# Altium project extBoard.PrjPcb
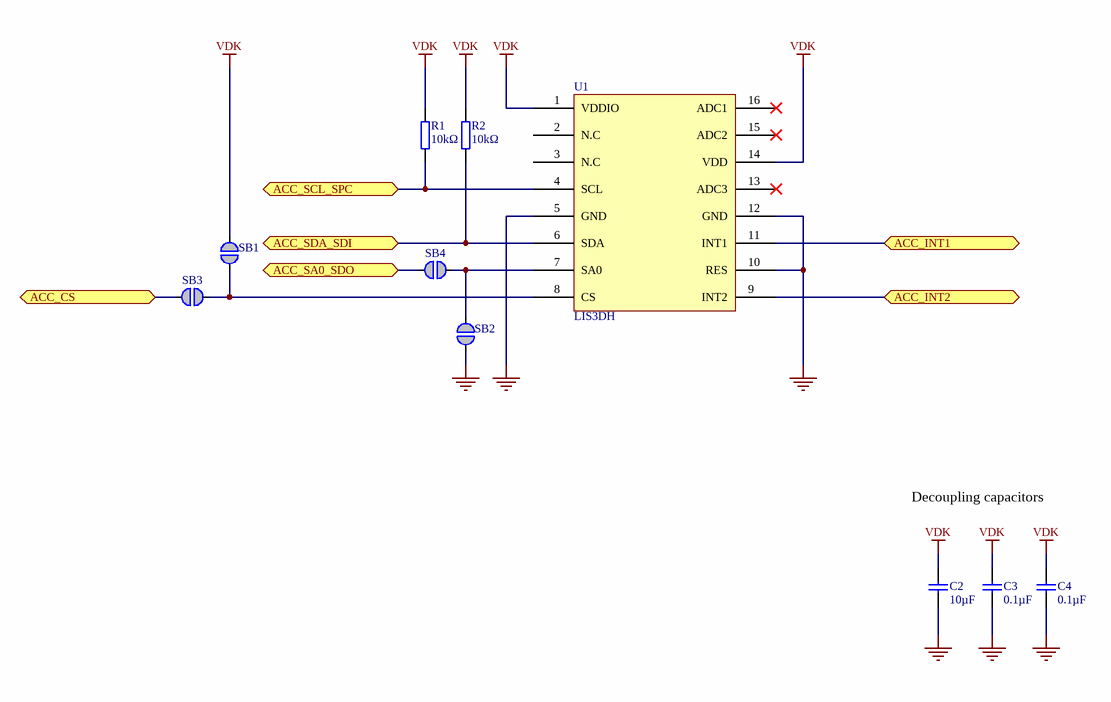
[diagram p0: extBoard_sheet2_acc.SchDoc]
4 sheets, 43 parts. Net scope: flat (ports and power ports of the same name join across sheets).
Board file: extBoard.PcbDoc
Sheets:
  extBoard_sheet2_acc.SchDoc
  extBoard_sheet3_interrupt_generator.SchDoc
  extBoard_sheet4_adc.SchDoc
  extBoard_sheet5_connectors.SchDoc

## Sheet extBoard_sheet2_acc.SchDoc: EXT BOARD - Accelerometer
size A4; Revision: 0.1.0; SheetNumber: 2; SheetTotal: 5; Author: NALO; DrawnBy: NALO; DocumentSize: A4; PCAName: EXT BOARD; ProjectName: Bachelor's Thesis

### Parts
C2  10µF  [CAPC2012X11L]
C3  0.1µF  [CAPC2012X11L]
C4  0.1µF  [CAPC2012X11L]
R1  10kΩ  [R0805]
R2  10kΩ  [R0805]
SB1  Solderbridge  [Solderbridge]  (value not drawn)  (no BOM)
SB2  Solderbridge  [Solderbridge]  (value not drawn)  (no BOM)
SB3  Solderbridge  [Solderbridge]  (value not drawn)  (no BOM)
SB4  Solderbridge  [Solderbridge]  (value not drawn)  (no BOM)
U1  LIS3DH  [LGA-16 (3x3x1.0mm)]

### Ports
ACC_CS (bidir), ACC_INT1 (bidir), ACC_INT2 (bidir), ACC_SA0_SDO (bidir), ACC_SCL_SPC (bidir), ACC_SDA_SDI (bidir)

### Nets
GND: C2.1 C3.1 C4.1 SB2.2 U1.5(GND) U1.10(RES) U1.12(GND)
VDK: C2.2 C3.2 C4.2 R1.2 R2.2 SB1.1 U1.1(VDDIO) U1.14(VDD)
A0: R1.1 U1.4(SCL) ; port ACC_SCL_SPC
A1: R2.1 U1.6(SDA) ; port ACC_SDA_SDI
A2: SB4.1 ; port ACC_SA0_SDO
A3: SB3.2 ; port ACC_CS
A4: U1.9(INT2) ; port ACC_INT2
A5: U1.11(INT1) ; port ACC_INT1
NetSB1_2: SB1.2 SB3.1 U1.8(CS)
NetSB2_1: SB2.1 SB4.2 U1.7(SA0)

Not connected (* = marked no-connect by the designer): U1 2(N.C) 3(N.C) 13(ADC3)* 15(ADC2)* 16(ADC1)*

### Notes on the sheet
- Decoupling capacitors
- Title
- Size
- Date:
- Project Number
- Sheet         of
- Revision
- File:
- Drawn By:

### Library data of the parts
C2-C4 = CAP_0805: Capacitor, X5R, ±10%; Part Number: C0805-4µ7; Note: 16V; Artikkelnr Noca: 20039266; Artikkelnr Simpro: N.A.; Manufacturer: *; Manufacturer Part Number: *; Datasheet: *; Footprint Doc: 0805; LatestRevisionDate: 2013-06-04; Pin Count: 2; Publisher: Nordic Semiconductor; Published: 2009-08-21; Supplier: *; Supplier part number: *; 2nd source Supplier: *; 2nd source part number: *
  C2: Value: 10µF
  C3 C4: Value: 0.1µF
R1 R2 = R0805: Value: 10kΩ
SB1-SB4 = SOLDERBRIDGE: Artikkelnr Noca: N.A.; Part Number: Solderbridge; Manufacturer: *; Manufacturer Part Number: *; Datasheet: *; LatestRevisionDate: 2009-12-14; Pin Count: 2; Publisher: Nordic Semiconductor; Published: 2009-12-14; Value: Solderbridge; Note: *; Supplier: *; Supplier part number: *; 2nd source Supplier: *; 2nd source part number: *; Footprint Doc: Solderbridge; Artikkelnr Simpro: N.A.

## Sheet extBoard_sheet3_interrupt_generator.SchDoc: EXT BOARD - Interrupt Generator
size A4; Revision: 0.1.0; SheetNumber: 3; SheetTotal: 5; Author: NALO; DrawnBy: NALO; DocumentSize: A4; PCAName: EXT BOARD; ProjectName: Bachelor's Thesis
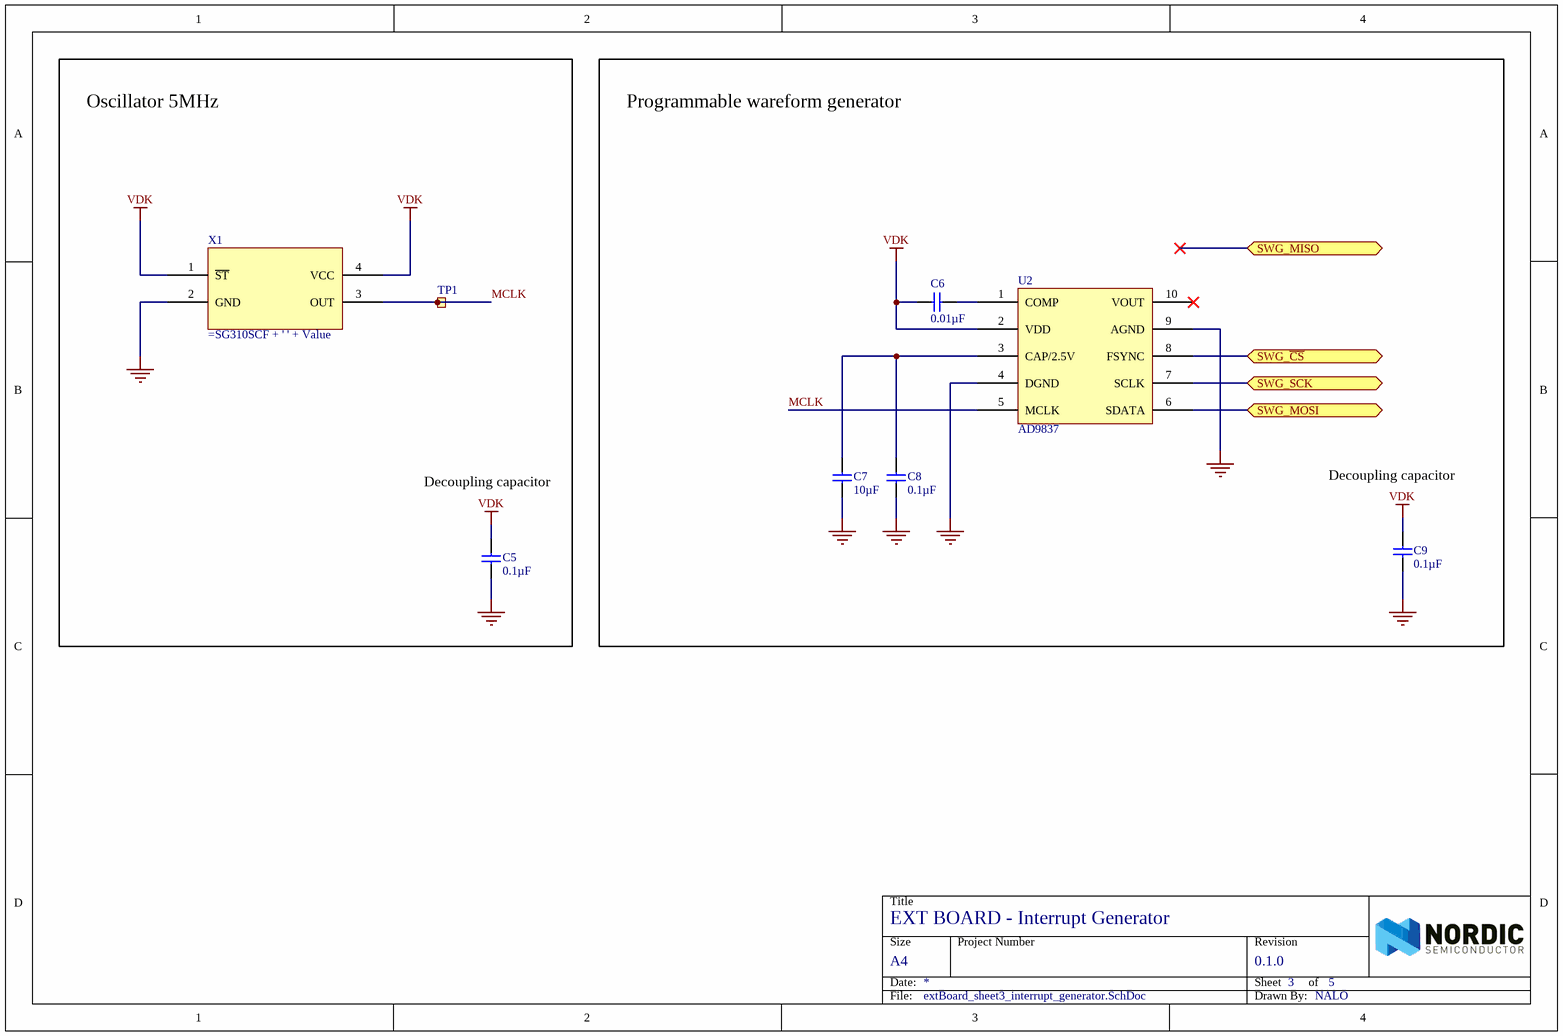
[diagram p1: extBoard_sheet3_interrupt_generator.SchDoc]

### Parts
C5  0.1µF  [CAPC2012X11L]
C6  0.01µF  [CAPC2012X11L]
C7  10µF  [CAPC2012X11L]
C8  0.1µF  [CAPC2012X11L]
C9  0.1µF  [CAPC2012X11L]
TP1  TP  [TESTPAD-TH]  (value not drawn)  (no BOM)
U2  AD9837  [DFN50P300X300X95-10N]
X1  (no value)  [SG310SCF]

### Blocks framed on the sheet
Oscillator 5MHz: C5 TP1 X1
Programmable wareform generator: C6-C9 U2

### Ports
SWG_MISO (bidir), SWG_MOSI (bidir), SWG_SCK (bidir), SWG_~{CS} (bidir)

### Nets
GND: C5.1 C7.1 C8.1 C9.1 U2.4(DGND) U2.9(AGND) X1.2(GND)
VDK: C5.2 C6.2 C9.2 U2.2(VDD) X1.1(~{ST}) X1.4(VCC)
D2: U2.8(FSYNC) ; port SWG_~{CS}
D3: U2.6(SDATA) ; port SWG_MOSI
D5: U2.7(SCLK) ; port SWG_SCK
MCLK: TP1.1 U2.5(MCLK) X1.3(OUT)
NetC6_1: C6.1 U2.1(COMP)
NetC7_2: C7.2 C8.2 U2.3(CAP/2.5V)

Not connected (* = marked no-connect by the designer): U2 10(VOUT)*

### Notes on the sheet
- Decoupling capacitor
- Title
- Size
- Date:
- Project Number
- Sheet         of
- Revision
- File:
- Drawn By:

### Library data of the parts
C5-C9 = CAP_0805: as C2 on sheet extBoard_sheet2_acc; Manufacturer: *; Manufacturer Part Number: *; Datasheet: *; Footprint Doc: 0805; LatestRevisionDate: 2013-06-04; Pin Count: 2; Publisher: Nordic Semiconductor; Published: 2009-08-21; Supplier: *; Supplier part number: *; 2nd source Supplier: *; 2nd source part number: *
  C5 C8 C9: Value: 0.1µF
  C6: Value: 0.01µF
  C7: Value: 10µF
TP1 = Testpoint TH: Testpoint, through hole; Artikkelnr Noca: N.A.; Part Number: Testpoint TH; Manufacturer: *; Manufacturer Part Number: *; Datasheet: *; Footprint Doc: TESTPAD-TH; LatestRevisionDate: 2009-12-12; Pin Count: 1; Publisher: Nordic Semiconductor; Published: 2009-12-12; Value: TP; Note: *; Supplier: *; Supplier part number: *; 2nd source Supplier: *; 2nd source part number: *; Artikkelnr Simpro: N.A.
X1 = SG310SCF: Value: 16MHz

## Sheet extBoard_sheet4_adc.SchDoc: EXT BOARD - A/D Converter
size A4; Revision: 0.1.0; SheetNumber: 4; SheetTotal: 5; Author: NALO; DrawnBy: NALO; DocumentSize: A4; PCAName: EXT BOARD; ProjectName: Bachelor's Thesis
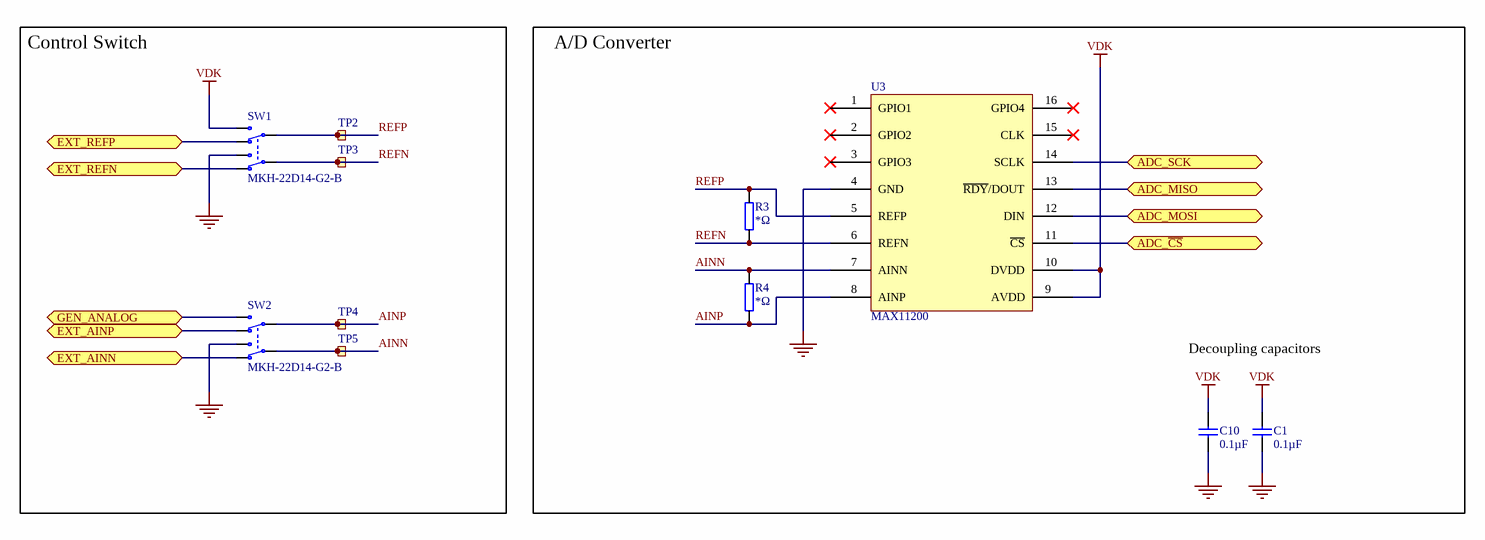
[diagram p2: extBoard_sheet4_adc.SchDoc]

### Parts
C1  0.1µF  [CAPC2012X11L]
C10  0.1µF  [CAPC2012X11L]
R3  *Ω  [R0805]
R4  *Ω  [R0805]
SW1  MKH-22D14-G2-B  [MKH-22D14-G2-B]
SW2  MKH-22D14-G2-B  [MKH-22D14-G2-B]
TP2  TP  [TESTPAD-TH]  (value not drawn)  (no BOM)
TP3  TP  [TESTPAD-TH]  (value not drawn)  (no BOM)
TP4  TP  [TESTPAD-TH]  (value not drawn)  (no BOM)
TP5  TP  [TESTPAD-TH]  (value not drawn)  (no BOM)
U3  MAX11200  [QSOP16]

### Blocks framed on the sheet
Control Switch: SW1 SW2 TP2-TP5
A/D Converter: C1 C10 R3 R4 U3

### Ports
ADC_MISO (bidir), ADC_MOSI (bidir), ADC_SCK (bidir), ADC_~{CS} (bidir), EXT_AINN (bidir), EXT_AINP (bidir), EXT_REFN (bidir), EXT_REFP (bidir), GEN_ANALOG (bidir)

### Nets
GND: C1.1 C10.1 SW1.1(N.O-1) SW2.1(N.O-1) U3.4(GND)
VDK: C1.2 C10.2 SW1.4(N.O-2) U3.9(AVDD) U3.10(DVDD)
ADC_~{CS}: U3.11(~{CS}) ; port ADC_~{CS}
ADC_MISO: U3.13(~{RDY}/DOUT) ; port ADC_MISO
ADC_MOSI: U3.12(DIN) ; port ADC_MOSI
ADC_SCK: U3.14(SCLK) ; port ADC_SCK
AINN: R4.2 SW2.2(COM-1) TP5.1 U3.7(AINN)
AINP: R4.1 SW2.5(COM-2) TP4.1 U3.8(AINP)
EXT_AINN: SW2.3(N.C-1) ; port EXT_AINN
EXT_AINP: SW2.6(N.C-2) ; port EXT_AINP
EXT_REFN: SW1.3(N.C-1) ; port EXT_REFN
EXT_REFP: SW1.6(N.C-2) ; port EXT_REFP
GEN_ANALOG: SW2.4(N.O-2) ; port GEN_ANALOG
REFN: R3.1 SW1.2(COM-1) TP3.1 U3.6(REFN)
REFP: R3.2 SW1.5(COM-2) TP2.1 U3.5(REFP)

Not connected (* = marked no-connect by the designer): U3 1(GPIO1)* 2(GPIO2)* 3(GPIO3)* 15(CLK)* 16(GPIO4)*

### Notes on the sheet
- Decoupling capacitors
- Title
- Size
- Date:
- Project Number
- Sheet         of
- Revision
- File:
- Drawn By:

### Library data of the parts
C1 C10 = CAP_0805: as C2 on sheet extBoard_sheet2_acc; Manufacturer: *; Manufacturer Part Number: *; Datasheet: *; Footprint Doc: 0805; LatestRevisionDate: 2013-06-04; Pin Count: 2; Publisher: Nordic Semiconductor; Published: 2009-08-21; Value: 0.1µF; Supplier: *; Supplier part number: *; 2nd source Supplier: *; 2nd source part number: *
R3 R4 = R0805: Value: *Ω
SW1 SW2 = MKH-22D14-G2-B: Slide Switch DPDT; Manufacturer: Dailywell; Artikkelnr Noca: 50019112; Artikkelnr Simpro: N.A.; Part Number: MKH-22D14-G2-B; Manufacturer Part Number: MKH-22D14-G2-B; Datasheet: \\hizz\pro\app9717\Datasheet\switches\Dailywell\MKH-22D14-G2-B.pdf; Footprint Doc: MKH-22D14-G2-B; LatestRevisionDate: 2016-08-18; Pin Count: 6; Publisher: Nordic Semiconductor; Published: 2016-08-18; Value: MKH-22D14-G2-B; Note: *; Supplier: *; Supplier part number: *; 2nd source Supplier: *; 2nd source part number: *
TP2-TP5 = Testpoint TH: as TP1 on sheet extBoard_sheet3_interrupt_generator; Part Number: Testpoint TH; Manufacturer: *; Manufacturer Part Number: *; Datasheet: *; Footprint Doc: TESTPAD-TH; LatestRevisionDate: 2009-12-12; Pin Count: 1; Publisher: Nordic Semiconductor; Published: 2009-12-12; Value: TP; Note: *; Supplier: *; Supplier part number: *; 2nd source Supplier: *; 2nd source part number: *; Artikkelnr Simpro: N.A.

## Sheet extBoard_sheet5_connectors.SchDoc: EXT BOARD - Connectors
size A4; Revision: 0.1.0; SheetNumber: 5; SheetTotal: 5; Author: NALO; DrawnBy: NALO; DocumentSize: A4; PCAName: EXT BOARD; ProjectName: Bachelor's Thesis
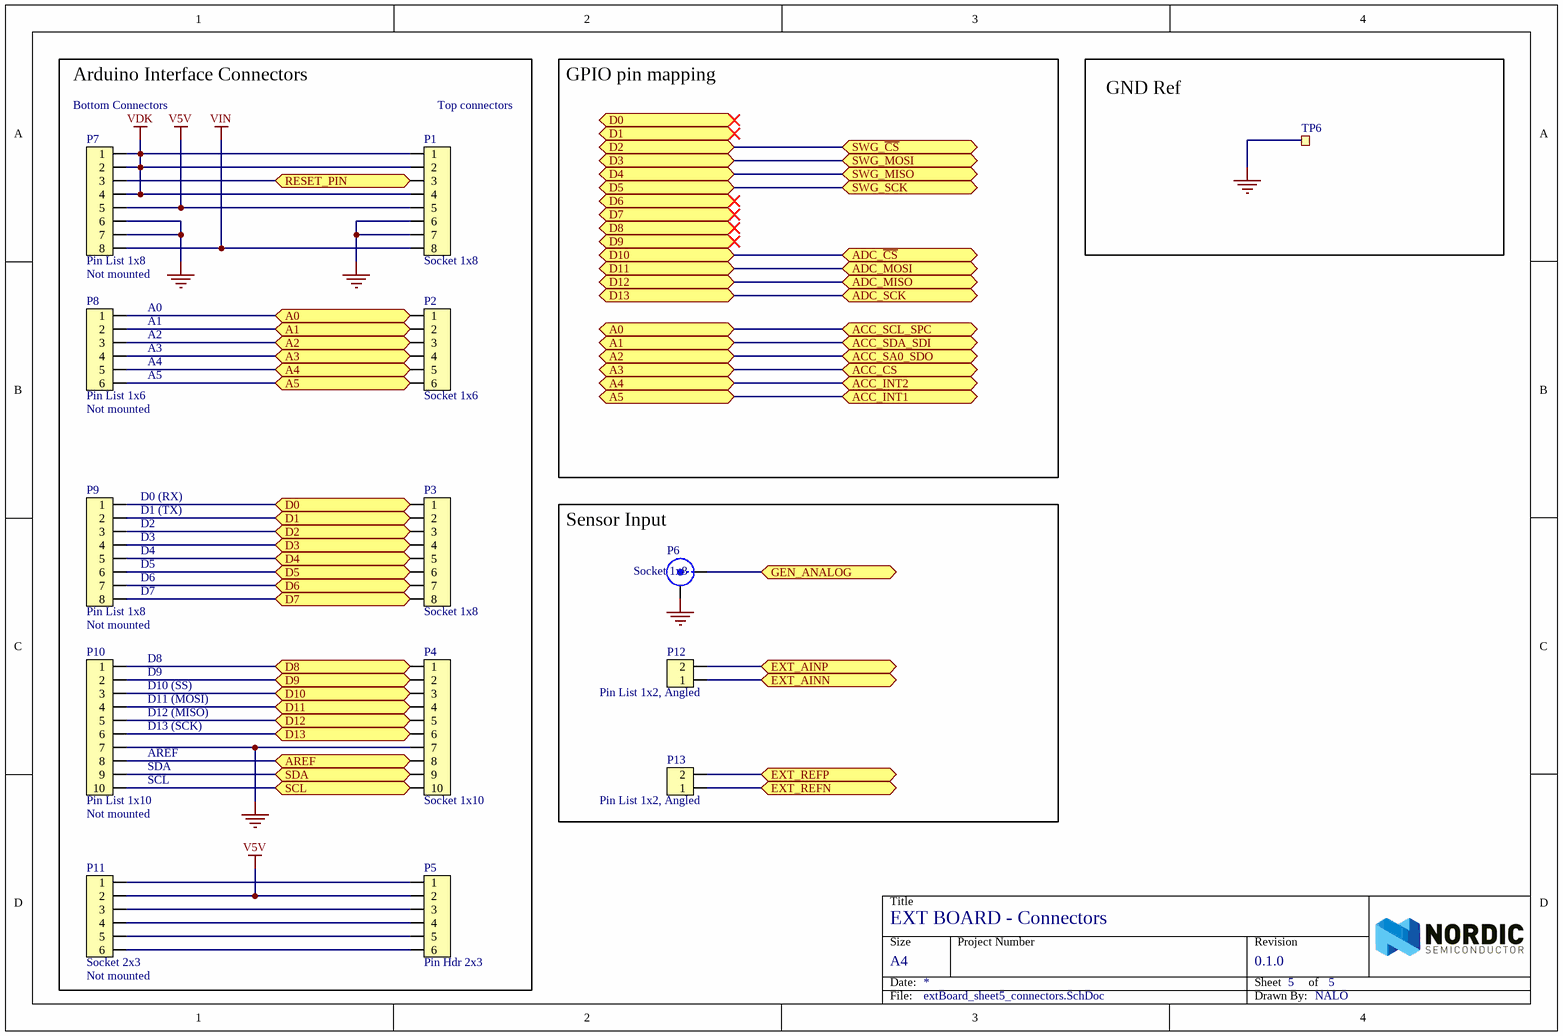
[diagram p3: extBoard_sheet5_connectors.SchDoc]

### Parts
P1  Socket 1x8  [SOCKET_1x8_SMD]
P2  Socket 1x6  [SOCKET_1x6_SMD]
P3  Socket 1x8  [SOCKET_1x8_SMD]
P4  Socket 1x10  [SOCKET_1x10_SMD]
P5  Pin Hdr 2x3  [HDR_2x3-SMD]
P6  Socket 1x8  [BNC_RA CON]
P7  Pin List 1x8  Assembly: Not mounted  [LIST_1x8_SMD]
P8  Pin List 1x6  Assembly: Not mounted  [LIST_1x6_SMD]
P9  Pin List 1x8  Assembly: Not mounted  [LIST_1x8_SMD]
P10  Pin List 1x10  Assembly: Not mounted  [LIST_1x10_SMD]
P11  Socket 2x3  Assembly: Not mounted  [SOCKET_2x3_SMD-2.54mm-bottom]
P12  Pin List 1x2, Angled  [LIST_ANG_1x2-SMD-2.54MM]
P13  Pin List 1x2, Angled  [LIST_ANG_1x2-SMD-2.54MM]
TP6  TP  [TESTPAD-TH]  (value not drawn)  (no BOM)

### Blocks framed on the sheet
Arduino Interface Connectors: P1-P5 P7-P11
GND Ref: TP6
Sensor Input: P6 P12 P13

### Ports
A0 (bidir), A1 (bidir), A2 (bidir), A3 (bidir), A4 (bidir), A5 (bidir), ACC_CS (bidir), ACC_INT1 (bidir), ACC_INT2 (bidir), ACC_SA0_SDO (bidir), ACC_SCL_SPC (bidir), ACC_SDA_SDI (bidir), ADC_MISO (bidir), ADC_MOSI (bidir), ADC_SCK (bidir), ADC_~{CS} (bidir), AREF (bidir), D0 (bidir), D1 (bidir), D2 (bidir), D3 (bidir), D4 (bidir), D5 (bidir), D6 (bidir), D7 (bidir), D8 (bidir), D9 (bidir), D10 (bidir), D11 (bidir), D12 (bidir), D13 (bidir), EXT_AINN (bidir), EXT_AINP (bidir), EXT_REFN (bidir), EXT_REFP (bidir), GEN_ANALOG (bidir), RESET_PIN (bidir), SCL (bidir), SDA (bidir), SWG_MISO (bidir), SWG_MOSI (bidir), SWG_SCK (bidir), SWG_~{CS} (bidir)

### Nets
GND: P1.6 P1.7 P4.7 P6.2(Y) P7.6 P7.7 P10.7 TP6.1
V5V: P1.5 P5.2 P7.5 P11.2
VDK: P1.1 P1.2 P1.4 P7.1 P7.2 P7.4
VIN: P1.8 P7.8
A0: P2.1 P8.1 ; port A0, port ACC_SCL_SPC
A1: P2.2 P8.2 ; port A1, port ACC_SDA_SDI
A2: P2.3 P8.3 ; port A2, port ACC_SA0_SDO
A3: P2.4 P8.4 ; port A3, port ACC_CS
A4: P2.5 P8.5 ; port A4, port ACC_INT2
A5: P2.6 P8.6 ; port A5, port ACC_INT1
ADC_~{CS}: P4.3 P10.3 ; port D10, port ADC_~{CS}
ADC_MISO: P4.5 P10.5 ; port D12, port ADC_MISO
ADC_MOSI: P4.4 P10.4 ; port D11, port ADC_MOSI
ADC_SCK: P4.6 P10.6 ; port D13, port ADC_SCK
AREF: P4.8 P10.8 ; port AREF
D0: P3.1 P9.1 ; port D0
D1: P3.2 P9.2 ; port D1
D2: P3.3 P9.3 ; port D2, port SWG_~{CS}
D3: P3.4 P9.4 ; port D3, port SWG_MOSI
D4: P3.5 P9.5 ; port D4, port SWG_MISO
D5: P3.6 P9.6 ; port D5, port SWG_SCK
D6: P3.7 P9.7 ; port D6
D7: P3.8 P9.8 ; port D7
D8: P4.1 P10.1 ; port D8
D9: P4.2 P10.2 ; port D9
EXT_AINN: P12.1 ; port EXT_AINN
EXT_AINP: P12.2 ; port EXT_AINP
EXT_REFN: P13.1 ; port EXT_REFN
EXT_REFP: P13.2 ; port EXT_REFP
GEN_ANALOG: P6.1(X) ; port GEN_ANALOG
RESET_PIN: P1.3 P7.3 ; port RESET_PIN
SCL: P4.10 P10.10 ; port SCL
SDA: P4.9 P10.9 ; port SDA
NetP5_1: P5.1 P11.1
NetP5_3: P5.3 P11.3
NetP5_4: P5.4 P11.4
NetP5_5: P5.5 P11.5
NetP5_6: P5.6 P11.6

### Notes on the sheet
- (near P7) Bottom Connectors
- (near P1) Top connectors
- GPIO pin mapping
- (near P8) A0
- (near P8) A1
- (near P8) A2
- (near P8) A3
- (near P8) A4
- (near P8) A5
- (near P9) D0 (RX)
- (near P9) D1 (TX)
- (near P9) D2
- (near P9) D3
- (near P9) D4
- (near P9) D5
- (near P9) D6
- (near P9) D7
- (near P10) D8
- (near P10) D9
- (near P10) D10 (SS)
- (near P10) D11 (MOSI)
- (near P10) D12 (MISO)
- (near P10) AREF
- (near P10) D13 (SCK)
- (near P10) SDA
- (near P10) SCL
- Title
- Size
- Date:
- Project Number
- Sheet         of
- Revision
- File:
- Drawn By:

### Library data of the parts
P1 P3 = Socket 1x8 SMD: Socket 1x8, 2.54mm (100mil), SMD; Manufacturer: W-CON; Manufacturer Part Number: 2171-108MS0CUNR1; 2nd source part number: SSM-108-F-SV-P-TR; Artikkelnr Noca: 55030002; Artikkelnr Simpro: N.A.; Part Number: Socket 1x8 SMD; Datasheet: *; Footprint Doc: SOCKET_1x8_SMD; LatestRevisionDate: 2016-01-22; Pin Count: 8; Publisher: Nordic Semiconductor; Published: 2016-01-22; Value: Socket 1x8; Note: *; Supplier: Cabcon; Supplier part number: 2171-108MS0CUNR1; 2nd source Supplier: Samtec
P2 = Socket 1x6 SMD: Socket 1x6, 2.54mm (100mil), SMD; Manufacturer: W-CON; Manufacturer Part Number: 2171-106MS0CUNR1; 2nd source part number: SSM-106-F-SV-P-TR; Artikkelnr Noca: 55030001; Artikkelnr Simpro: N.A.; Part Number: Socket 1x6 SMD; Datasheet: *; Footprint Doc: SOCKET_1x6_SMD; LatestRevisionDate: 2016-01-22; Pin Count: 6; Publisher: Nordic Semiconductor; Published: 2016-01-22; Value: Socket 1x6; Note: *; Supplier: Cabcon; Supplier part number: 2171-106MS0CUNR1; 2nd source Supplier: Samtec
P4 = Socket 1x10 SMD: Socket 1x10, 2.54mm (100mil), SMD; Manufacturer: W-CON; Manufacturer Part Number: 2171-110MS0CUNR1; 2nd source part number: SSM-110-F-SV-P-TR; Artikkelnr Noca: 55030004; Artikkelnr Simpro: N.A.; Part Number: Socket 1x10 SMD; Datasheet: *; Footprint Doc: SOCKET_1x10_SMD; LatestRevisionDate: 2016-01-22; Pin Count: 10; Publisher: Nordic Semiconductor; Published: 2016-01-22; Value: Socket 1x10; Note: *; Supplier: Cabcon; Supplier part number: 2171-110MS0CUNR1; 2nd source Supplier: Samtec
P5 = Pin Header 2x3 SMD: Pin Header 2x3, 2.54mm (100mil) SMD; Manufacturer: W-CON; Manufacturer Part Number: 1125-1203S0M116R1; 2nd source part number: TSM-103-01-L-DV; Artikkelnr Noca: 55010007; Artikkelnr Simpro: N.A.; Part Number: Pin Header 2x3 SMD; Datasheet: \\hizz\pro\app9717\Datasheet\connectores\W-CON\1125-12XXXXMXXXXX.PDF; Footprint Doc: HDR_2x3-SMD; LatestRevisionDate: 2016-01-22; Pin Count: 6; Publisher: Nordic Semiconductor; Published: 2016-01-22; Value: Pin Hdr 2x3; Note: SMD; Supplier: Cabcon; Supplier part number: 1125-1203S0M116R1; 2nd source Supplier: Samtec
P6 = BNC: BNC Elbow Connector; LatestRevisionDate: 17-Jul-2002; LatestRevisionNote: Re-released for DXP Platform.; Publisher: Altium Limited
P7 P9 = Pin List 1x8 SMD: Pin List 1x8, 2.54mm (100mil), SMD; Manufacturer: W-CON; Manufacturer Part Number: 1125-1108S0M116R2; 2nd source part number: TSM-108-01-L-SV-P-TR; Artikkelnr Noca: 55010006; Artikkelnr Simpro: N.A.; Part Number: Pin List 1x8 SMD; Datasheet: \\hizz\pro\app9717\Datasheet\connectores\W-CON\1125-11XXXXMXXXXX.pdf; LatestRevisionDate: 2016-01-22; Publisher: Nordic Semiconductor; Published: 2016-01-22; Value: Pin List 1x8; Note: *; Supplier: Cabcon; Supplier part number: 1125-1108S0M116R2; 2nd source Supplier: Samtec; Pin Count: 8; Footprint Doc: LIST_1x8_SMD
P8 = Pin List 1x6 SMD: Pin List 1x6, 2.54mm (100mil), SMD; Manufacturer: W-CON; Manufacturer Part Number: 1125-1106S0M116R2; 2nd source part number: TSM-106-01-L-SV-P-TR; Artikkelnr Noca: 55010026; Artikkelnr Simpro: N.A.; Part Number: Pin List 1x6 SMD; Datasheet: \\hizz\pro\app9717\Datasheet\connectores\W-CON\1125-11XXXXMXXXXX.pdf; LatestRevisionDate: 2016-03-29; Pin Count: 6; Publisher: Nordic Semiconductor; Published: 2016-03-29; Value: Pin List 1x6; Note: *; Supplier: Cabcon; Supplier part number: 1125-1106S0M116R2; 2nd source Supplier: Samtec; Footprint Doc: LIST_1x6_SMD
P10 = Pin List 1x10 SMD: Pin List 1x10, 2.54mm (100mil), SMD; Manufacturer: W-CON; Manufacturer Part Number: 1125-1110S0M116R2; 2nd source part number: TSM-110-01-L-SV-P-TR; Artikkelnr Noca: 55010028; Artikkelnr Simpro: N.A.; Part Number: Pin List 1x10 SMD; Datasheet: \\hizz\pro\app9717\Datasheet\connectores\W-CON\1125-11XXXXMXXXXX.pdf; LatestRevisionDate: 2016-03-29; Publisher: Nordic Semiconductor; Published: 2016-03-29; Value: Pin List 1x10; Note: *; Supplier: Cabcon; Supplier part number: 1125-1110S0M116R2; 2nd source Supplier: Samtec; Pin Count: 10; Footprint Doc: LIST_1x10_SMD
P11 = Socket 2x3 SMD Bottom: Socket 2x3, 2.54mm (100mil), SMD; Manufacturer: W-CON; Manufacturer Part Number: 2171-203MS0CUNR1; 2nd source part number: SSM-103-F-DV-P-TR; Artikkelnr Noca: 55030010; Artikkelnr Simpro: N.A.; Part Number: Socket 2x3 SMD Bottom; Datasheet: \\hizz\pro\app9717\Datasheet\connectores\W-CON\2171-2XXMXXCUNXX.pdf; LatestRevisionDate: 2016-03-29; Pin Count: 6; Publisher: Nordic Semiconductor; Published: 2014-06-10; Value: Socket 2x3; Note: *; Supplier: Cabcon; Supplier part number: 2171-203MS0CUNR1; 2nd source Supplier: Samtec; Footprint Doc: SOCKET_2x3_SMD-2.54mm-bottom
P12 P13 = Pin List Ang 1x2 SMD, 2.54mm: Pin List 1x2, 2.54mm (100mil), Right Angled, SMD; Manufacturer: W-CON; Manufacturer Part Number: 1125B-1102S0Z135R2; 2nd source part number: TSM-102-01-L-SH-A; Artikkelnr Noca: 55010023; Artikkelnr Simpro: N.A.; Part Number: Pin List Ang 1x2 SMD, 2.54mm; Datasheet: \\hizz\pro\app9717\Datasheet\connectores\W-CON\1125B-11XXXXZXXXXX.pdf; Footprint Doc: LIST_ANG_1x2-SMD-2.54MM; LatestRevisionDate: 2016-05-26; Pin Count: 2; Publisher: Nordic Semiconductor; Published: 2016-01-22; Value: Pin List 1x2, Angled; Note: *; Supplier: Cabcon; Supplier part number: 1125B-1102S0Z135R2; 2nd source Supplier: Samtec
TP6 = Testpoint TH: as TP1 on sheet extBoard_sheet3_interrupt_generator; Part Number: Testpoint TH; Manufacturer: *; Manufacturer Part Number: *; Datasheet: *; Footprint Doc: TESTPAD-TH; LatestRevisionDate: 2009-12-12; Pin Count: 1; Publisher: Nordic Semiconductor; Published: 2009-12-12; Value: TP; Note: *; Supplier: *; Supplier part number: *; 2nd source Supplier: *; 2nd source part number: *; Artikkelnr Simpro: N.A.

## Nets that join several sheets
GND: extBoard_sheet2_acc (7 pins), extBoard_sheet3_interrupt_generator (7 pins), extBoard_sheet4_adc (5 pins), extBoard_sheet5_connectors (8 pins)
VDK: extBoard_sheet2_acc (8 pins), extBoard_sheet3_interrupt_generator (6 pins), extBoard_sheet4_adc (5 pins), extBoard_sheet5_connectors (6 pins)
A0: extBoard_sheet2_acc (R1.1 U1.4), extBoard_sheet5_connectors (P2.1 P8.1)
A1: extBoard_sheet2_acc (R2.1 U1.6), extBoard_sheet5_connectors (P2.2 P8.2)
A2: extBoard_sheet2_acc (SB4.1), extBoard_sheet5_connectors (P2.3 P8.3)
A3: extBoard_sheet2_acc (SB3.2), extBoard_sheet5_connectors (P2.4 P8.4)
A4: extBoard_sheet2_acc (U1.9), extBoard_sheet5_connectors (P2.5 P8.5)
A5: extBoard_sheet2_acc (U1.11), extBoard_sheet5_connectors (P2.6 P8.6)
ADC_~{CS}: extBoard_sheet4_adc (U3.11), extBoard_sheet5_connectors (P4.3 P10.3)
ADC_MISO: extBoard_sheet4_adc (U3.13), extBoard_sheet5_connectors (P4.5 P10.5)
ADC_MOSI: extBoard_sheet4_adc (U3.12), extBoard_sheet5_connectors (P4.4 P10.4)
ADC_SCK: extBoard_sheet4_adc (U3.14), extBoard_sheet5_connectors (P4.6 P10.6)
D2: extBoard_sheet3_interrupt_generator (U2.8), extBoard_sheet5_connectors (P3.3 P9.3)
D3: extBoard_sheet3_interrupt_generator (U2.6), extBoard_sheet5_connectors (P3.4 P9.4)
D5: extBoard_sheet3_interrupt_generator (U2.7), extBoard_sheet5_connectors (P3.6 P9.6)
EXT_AINN: extBoard_sheet4_adc (SW2.3), extBoard_sheet5_connectors (P12.1)
EXT_AINP: extBoard_sheet4_adc (SW2.6), extBoard_sheet5_connectors (P12.2)
EXT_REFN: extBoard_sheet4_adc (SW1.3), extBoard_sheet5_connectors (P13.1)
EXT_REFP: extBoard_sheet4_adc (SW1.6), extBoard_sheet5_connectors (P13.2)
GEN_ANALOG: extBoard_sheet4_adc (SW2.4), extBoard_sheet5_connectors (P6.1)